# Altium schematic sheet VS1003.SchDoc
size A3
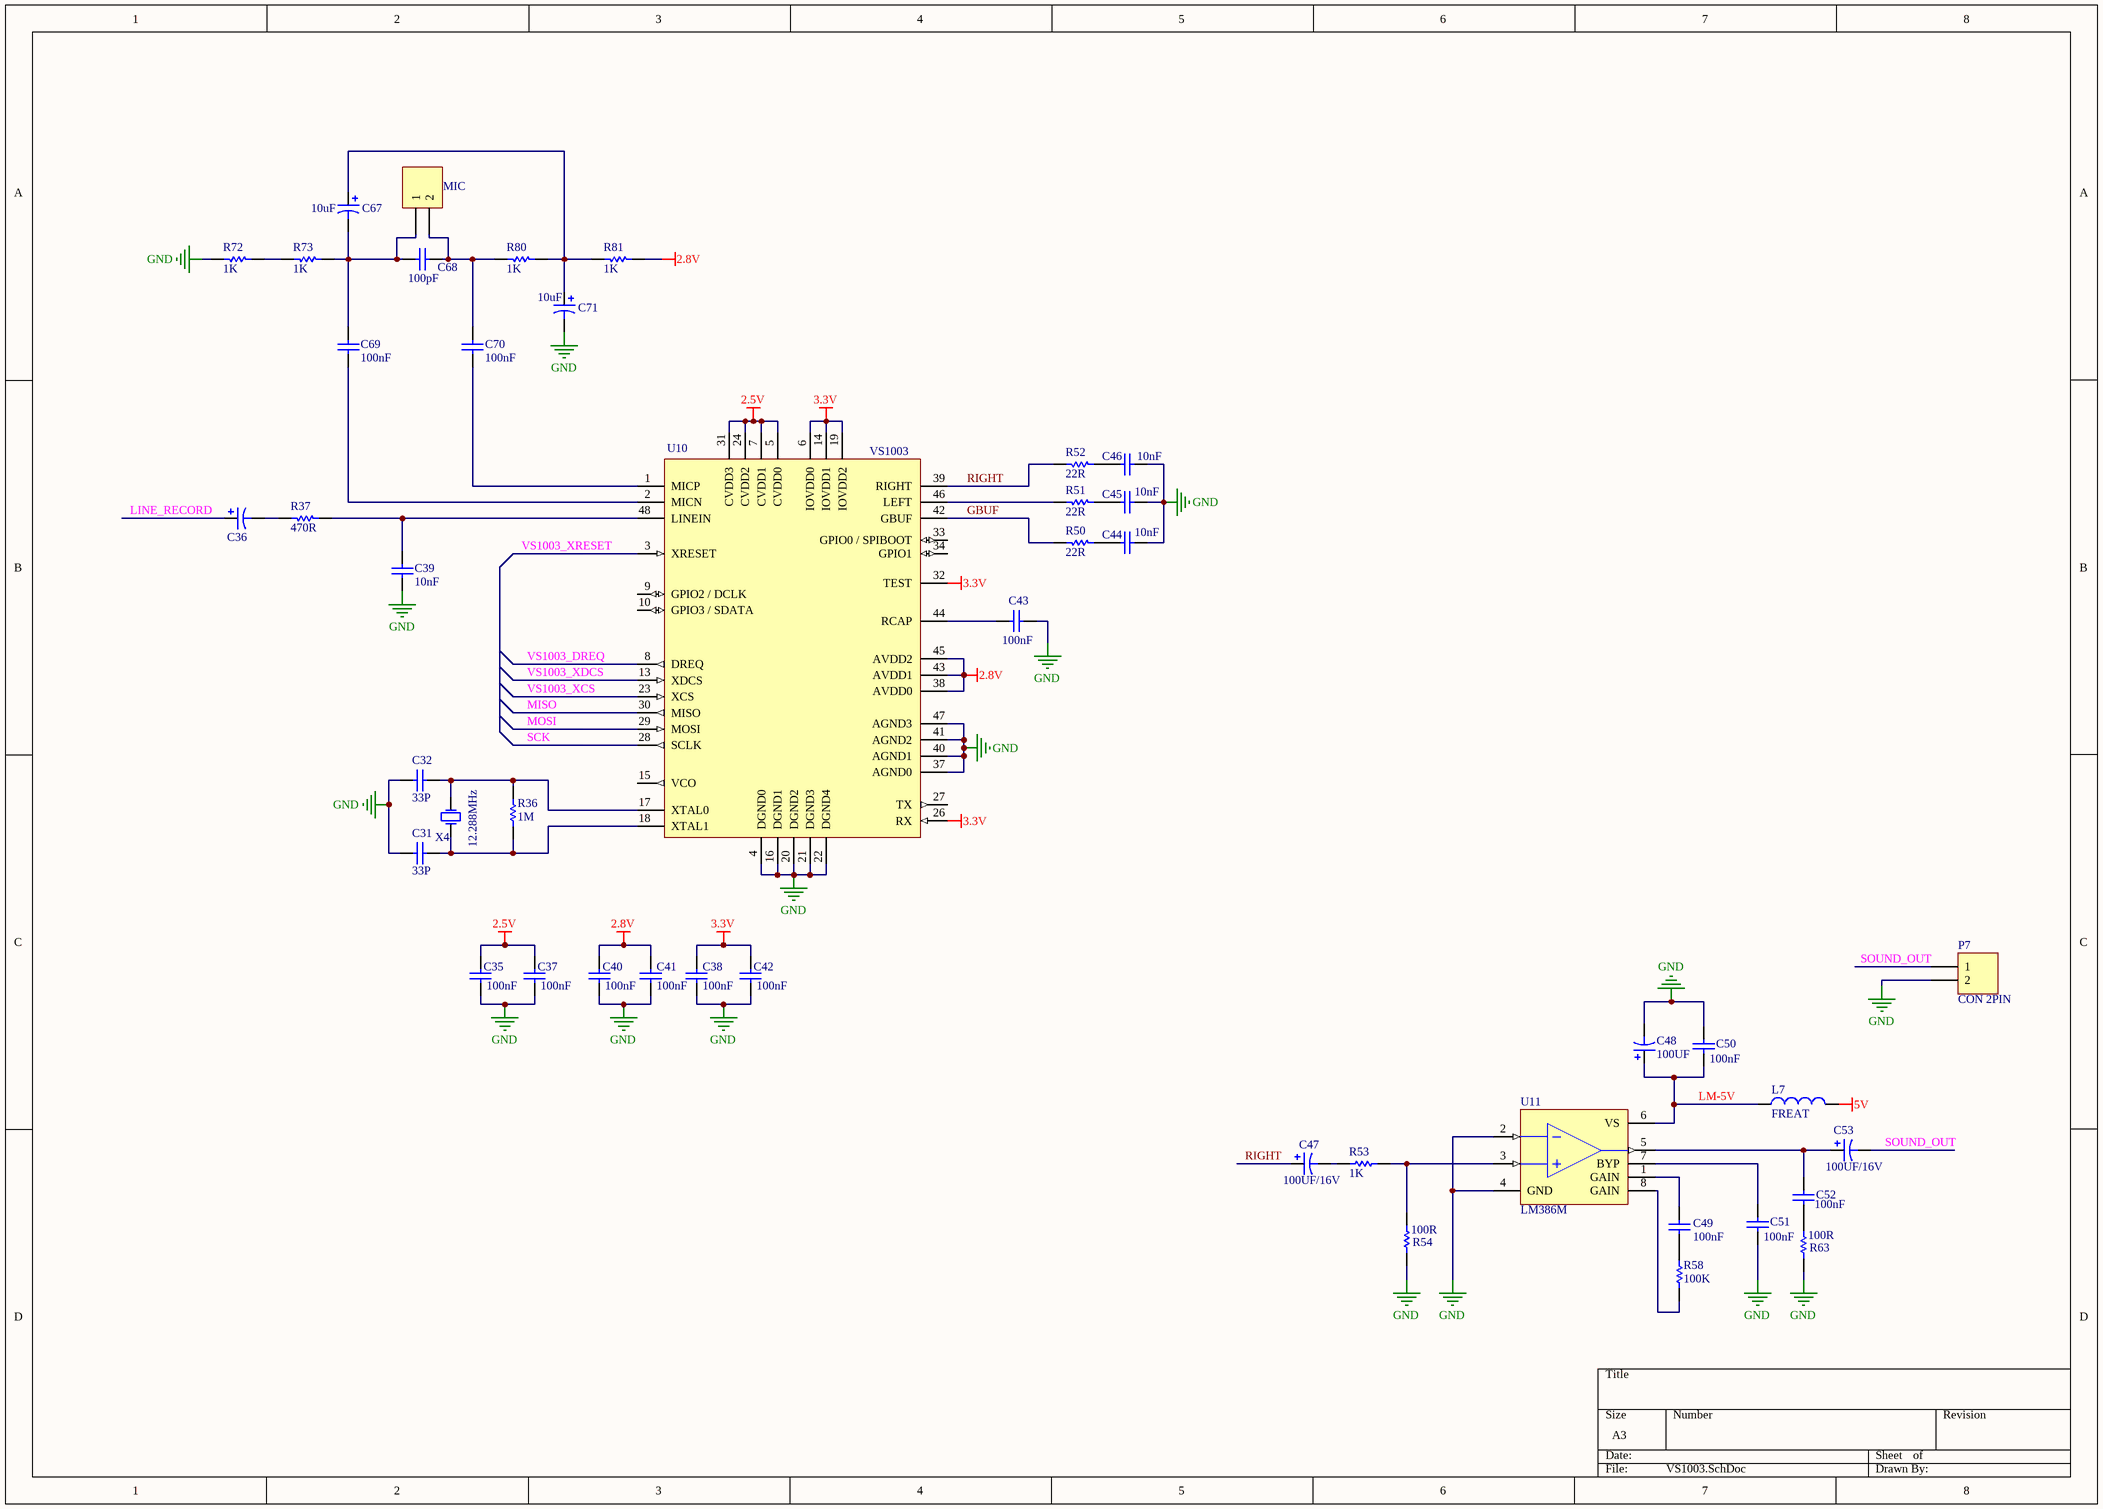
[diagram p0: VS1003.SchDoc]

## Parts
C31  33P  [0805c]
C32  33P  [0805c]
C35  100nF  [0805C]
C36  100uF / 16V SMD  [100UF-SMD]  (value not drawn)
C37  100nF  [0805C]
C38  100nF  [0805C]
C39  10nF  [0805C]
C40  100nF  [0805C]
C41  100nF  [0805C]
C42  100nF  [0805C]
C43  100nF  [0805C]
C44  10nF  [0805C]
C45  10nF  [0805C]
C46  10nF  [0805C]
C47  value 100UF/16V  [100UF-SMD]  (hidden comment: 100uF / 16V SMD)
C48  value 100UF  [100uf-smd]  (hidden comment: 100uF / 16V SMD)
C49  100nF  [0805c]
C50  100nF  [0805c]
C51  100nF  [0805c]
C52  100nF  [0805c]
C53  value 100UF/16V  [100UF-SMD]  (hidden comment: 100uF / 16V SMD)
C67  10uF  [10UF-SMD]
C68  100pF  [0805C]
C69  100nF  [0805C]
C70  100nF  [0805C]
C71  10uF  [10UF-SMD]
L7  FREAT  [1206]
MIC  CON 2PIN  [Microphone]  (value not drawn)
P7  CON 2PIN  [CON_2PIN]
R36  1M  [0805]
R37  470R  [0805]
R50  22R  [0805]
R51  22R  [0805]
R52  22R  [0805]
R53  1K  [0805]
R54  100R  [0805]
R58  100K  [0805]
R63  100R  [0805]
R72  1K  [0805]
R73  1K  [0805]
R80  1K  [0805]
R81  1K  [0805]
U10  VS1003  [48A]
U11  LM386M  [M08A_N]
X4  12.288MHz  [crystal]

## Nets
2.5V: C35.2 C37.2 U10.5(CVDD0) U10.7(CVDD1) U10.24(CVDD2) U10.31(CVDD3)
2.8V: C40.2 C41.2 R81.1 U10.38(AVDD0) U10.43(AVDD1) U10.45(AVDD2)
3.3V: C38.2 C42.2 U10.6(IOVDD0) U10.14(IOVDD1) U10.19(IOVDD2) U10.26(RX) U10.32(TEST)
5V: L7.2
GND: C31.2 C32.2 C35.1 C37.1 C38.1 C39.2 C40.1 C41.1 C42.1 C43.1 C44.2 C45.2 C46.2 C48.2 C50.2 C51.1 C71.2 P7.2 R54.2 R63.2 R72.2 U10.4(DGND0) U10.16(DGND1) U10.20(DGND2) U10.21(DGND3) U10.22(DGND4) U10.37(AGND0) U10.40(AGND1) U10.41(AGND2) U10.47(AGND3) U11.2(IN-) U11.4(GND)
GBUF: R50.2 U10.42(GBUF)
LINE_RECORD: C36.1
LM-5V: C48.1 C50.1 L7.1 U11.6(VS)
MISO: U10.30(MISO)
MOSI: U10.29(MOSI)
RIGHT: C47.1 R52.2 U10.39(RIGHT)
SCK: U10.28(SCLK)
SOUND_OUT: C53.2 P7.1
VS1003_DREQ: U10.8(DREQ)
VS1003_XCS: U10.23(XCS)
VS1003_XDCS: U10.13(XDCS)
VS1003_XRESET: U10.3(XRESET)
NetC31_1: C31.1 R36.2 U10.18(XTAL1) X4.2(OSC2)
NetC32_1: C32.1 R36.1 U10.17(XTAL0) X4.1(OSC1)
NetC36_2: C36.2 R37.2
NetC39_1: C39.1 R37.1 U10.48(LINEIN)
NetC43_2: C43.2 U10.44(RCAP)
NetC44_1: C44.1 R50.1
NetC45_1: C45.1 R51.1
NetC46_1: C46.1 R52.1
NetC47_2: C47.2 R53.1
NetC49_1: C49.1 R58.1
NetC49_2: C49.2 U11.1(GAIN)
NetC51_2: C51.2 U11.7(BYP)
NetC52_1: C52.1 R63.1
NetC52_2: C52.2 C53.1 U11.5(OUT)
NetC67_1: C67.1 C71.1 R80.1 R81.2
NetC67_2: C67.2 C68.2 C69.1 MIC.1 R73.1
NetC68_1: C68.1 C70.1 MIC.2 R80.2
NetC69_2: C69.2 U10.2(MICN)
NetC70_2: C70.2 U10.1(MICP)
NetR51_2: R51.2 U10.46(LEFT)
NetR53_2: R53.2 R54.1 U11.3(IN+)
NetR58_2: R58.2 U11.8(GAIN)
NetR72_1: R72.1 R73.2

Not connected (* = marked no-connect by the designer): U10 9(GPIO2_/_DCLK) 10(GPIO3_/_SDATA) 15(VCO) 27(TX) 33(GPIO0_/_SPIBOOT) 34(GPIO1)

## Library data of the parts
C31 C32 = Cap: Capacitor; Value: 33pF; Published: 8-Jun-2000; Revision: July-2002: Re-released for DXP Platform.; Publisher: Altium Limited
C35 C37-C46 C69 C70 = Cap: Capacitor; Value: 100pF; Published: 8-Jun-2000; Revision: July-2002: Re-released for DXP Platform.; Publisher: Altium Limited
C36 C47 C48 C53 C67 C71 = Cap Pol1: Polarized Capacitor (Radial)
  C36 C48 C53 C67 C71: Published: 8-Jun-2000; LatestRevisionDate: 17-Jul-2002; LatestRevisionNote: Re-released for DXP Platform.; PackageReference: RB7.6-15; Publisher: Altium Limited
C49-C52 C68 = Cap: Capacitor; Published: 8-Jun-2000; Publisher: Altium Limited
  C49-C52: LatestRevisionDate: 17-Jul-2002; LatestRevisionNote: Re-released for DXP Platform.; PackageReference: RAD-0.3
  C68: Revision: July-2002: Re-released for DXP Platform.; Value: 100pF
L7 = Inductor: Code_IEC: 1005; Value: 250mA; Published: 8-Jun-2000; LatestRevisionDate: 29-May-2009; LatestRevisionNote: IPC-7351 Footprint Added.; PackageReference: 0402-A; Publisher: Altium Limited; PackageDescription: Chip Inductor; Code_JEITA: 0402
MIC P7 = Header 2H: Header, 2-Pin, Right Angle; LatestRevisionDate: 17-Jul-2002; LatestRevisionNote: Re-released for DXP Platform.; Publisher: Altium Limited
R36 R50-R52 = Res1: Resistor; Value: 1K; Published: 8-Jun-2000; Revision: July-2002: Re-released for DXP Platform.; Publisher: Altium Limited
R37 = Res1: Resistor; Published: 8-Jun-2000; Revision: July-2002: Re-released for DXP Platform.; Publisher: Altium Limited; Value: 470R
R53 R54 R58 R63 = Res Semi: Semiconductor Resistor; Published: 8-Jun-2000; LatestRevisionDate: 17-Jul-2002; LatestRevisionNote: Re-released for DXP Platform.; PackageReference: AXIAL-0.5; Publisher: Altium Limited
  R53: Value: 1K
  R58: Value: 100K
R72 R73 R80 R81 = Res1: Resistor; Value: 470R; Published: 8-Jun-2000; Revision: July-2002: Re-released for DXP Platform.; Publisher: Altium Limited
U11 = LM386M-1: Low-Voltage Audio Power Amplifier; Published: 15-Apr-2002; LatestRevisionDate: 13-Apr-2006; LatestRevisionNote: IPC-7351 Footprint Added.; DatasheetVersion: Sep-1997; PackageVersion: Sep-1997; PackageReference: M08A; Publisher: Altium Limited; PackageDescription: 8-Pin Small Outline Integrated Circuit 1.27 mm Pitch; Code_JEDEC: MS-012-AA; Code_IPC: SOIC127P600-8; ComponentLink1Description: Manufacturer Link; ComponentLink1URL: http://www.national.com/; ComponentLink2Description: Datasheet; ComponentLink2URL: http://www.national.com/ds.cgi/LM/LM386.pdf; ComponentLink3Description: URL Link1; ComponentLink3URL: http://www.national.com/pf/LM/LM386.html
X4 = XTAL: Crystal Oscillator; Published: 8-Jun-2000; Revision: July-2002: Re-released for DXP Platform.; Publisher: Altium Limited